# EAGLE design bristlebot (EAGLE 6.4)
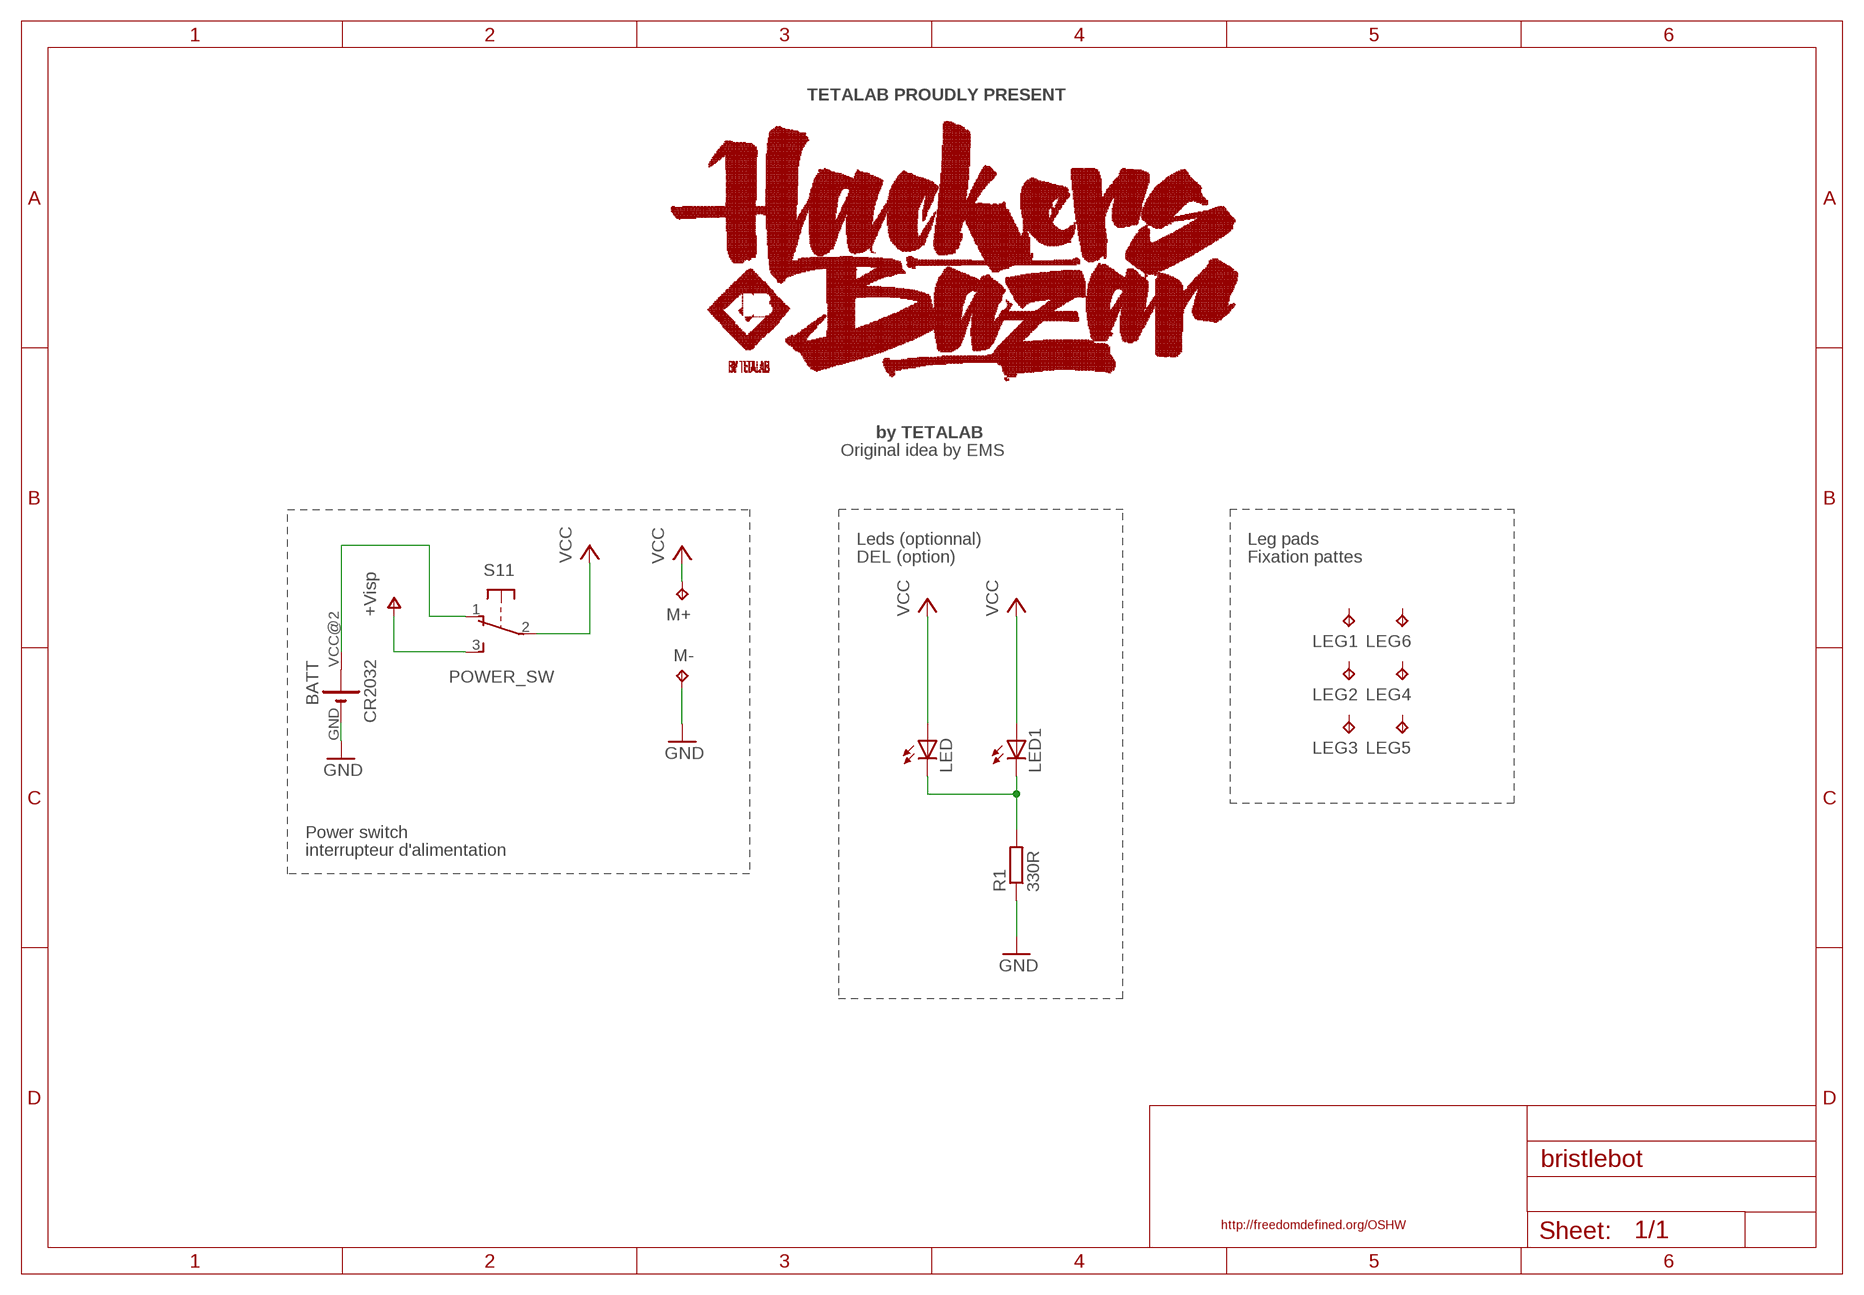
[diagram p0: schematic, sheet 1]

## Parts
BATT  CR2032  CR2032HCOMPACT  [BATT_CONN_CR2032]
LED  LED3MM  [LED3MM]
LED1  LED3MM  [LED3MM]
LEG1  TPPAD0.8-2.5R  [P0.8-2.5]
LEG2  TPPAD0.8-2.5R  [P0.8-2.5]
LEG3  TPPAD0.8-2.5R  [P0.8-2.5]
LEG4  TPPAD0.8-2.5R  [P0.8-2.5]
LEG5  TPPAD0.8-2.5R  [P0.8-2.5]
LEG6  TPPAD0.8-2.5R  [P0.8-2.5]
M+  TPPAD0.8-2R  [P0.8-2]
M-  TPPAD0.8-2R  [P0.8-2]
R1  330R  R-EU_0207/7  [0207/7]
S1  POWER_SW  SLIDING_SWITCH_SPDT-OS102011MA1QN1  [OS102011MA1QN1]

## Nets
GND: BATT.GND(-) M-.TP R1.1
N$12: LED1.K(C) LED.K(C) R1.2
V+: S1.3 ; supply symbol labelled +Visp
VBAT: BATT.VCC@2(+) S1.1
VCC: LED1.A LED.A M+.TP S1.2
Unconnected: BATT.VCC@1(+) LEG1.TP LEG2.TP LEG3.TP LEG4.TP LEG5.TP LEG6.TP S1.MT1(MT) S1.MT2(MT)

## Notes on the sheet
- TETALAB PROUDLY PRESENT
- by TETALAB
- Original idea by EMS
- Leds (optionnal) | Leg pads
- DEL (option) | Fixation pattes
- Power switch
- interrupteur d'alimentation
- http://freedomdefined.org/OSHW

## Library data of the parts
BATT = SnootLib:CR2032H: LI BATTERY CR2032
LED LED1 = led:LED: LED OSRAM: - CHIPLED LG R971, LG N971, LY N971, LG Q971, LY Q971, LO R971, LY R971 LH N974, LH R974 LS Q976, LO Q976, LY Q976 LO Q996 - Hyper CHIPLED LW Q18S LB Q993, LB Q99A, LB R99A - SideLED LS A670, LO A670, LY A670, LG A670, LP A670 LB A673, LV A673, LT A673, LW A673 LH A674 LY A675 LS A676, LA A676, LO A676, LY A676, LW A676 LS A679, LY A679, LG A679 - Hyper Micro SIDELED® LS Y876, LA Y876, LO Y876, LY Y876 LT Y87S - SmartLED LW L88C, LW L88S LB L89C, LB L89S, LG L890 LS L89K, LO L89K, LY L89K LS L896, LA L896, LO L896, LY L896 - TOPLED LS T670, LO T670, LY T670, LG T670, LP T670 LSG T670, LSP T670, LSY T670, LOP T670, LYG T670 LG T671, LOG T671, LSG T671 LB T673, LV T673, LT T673, LW T673 LH T674 LS T676, LA T676, LO T676, LY T676, LB T676, LH T676, LSB T676, LW T676 LB T67C, LV T67C, LT T67C, LS T67K, LO T67K, LY T67K, LW E67C LS E67B, LA E67B, LO E67B, LY E67B, LB E67C, LV E67C, LT E67C LW T67C LS T679, LY T679, LG T679 LS T770, LO T770, LY T770, LG T770, LP T770 LB T773, LV T773, LT T773, LW T773 LH T774 LS E675, LA E675, LY E675, LS T675 LS T776, LA T776, LO T776, LY T776, LB T776 LHGB T686 LT T68C, LB T68C - Hyper Mini TOPLED® LB M676 - Mini TOPLED Santana® LG M470 LS M47K, LO M47K, LY M47K Source: http://www.osram.convergy.de LUXEON: - LUMILED® LXK2-PW12-R00, LXK2-PW12-S00, LXK2-PW14-U00, LXK2-PW14-V00 LXK2-PM12-R00, LXK2-PM12-S00, LXK2-PM14-U00 LXK2-PE12-Q00, LXK2-PE12-R00, LXK2-PE12-S00, LXK2-PE14-T00, LXK2-PE14-U00 LXK2-PB12-K00, LXK2-PB12-L00, LXK2-PB12-M00, LXK2-PB14-N00, LXK2-PB14-P00, LXK2-PB14-Q00 LXK2-PR12-L00, LXK2-PR12-M00, LXK2-PR14-Q00, LXK2-PR14-R00 LXK2-PD12-Q00, LXK2-PD12-R00, LXK2-PD12-S00 LXK2-PH12-R00, LXK2-PH12-S00 LXK2-PL12-P00, LXK2-PL12-Q00, LXK2-PL12-R00 Source: www.luxeon.com KINGBRIGHT: KA-3528ASYC Source: www.kingbright.com
LEG1-LEG6 M+ M- = malib:TP: Test pad
R1 = resistor:R-EU_: RESISTOR, European symbol
S1 = SnootLib:SLIDING_SWITCH_SPDT: Sliding Switch right-angle SPDT

## Board
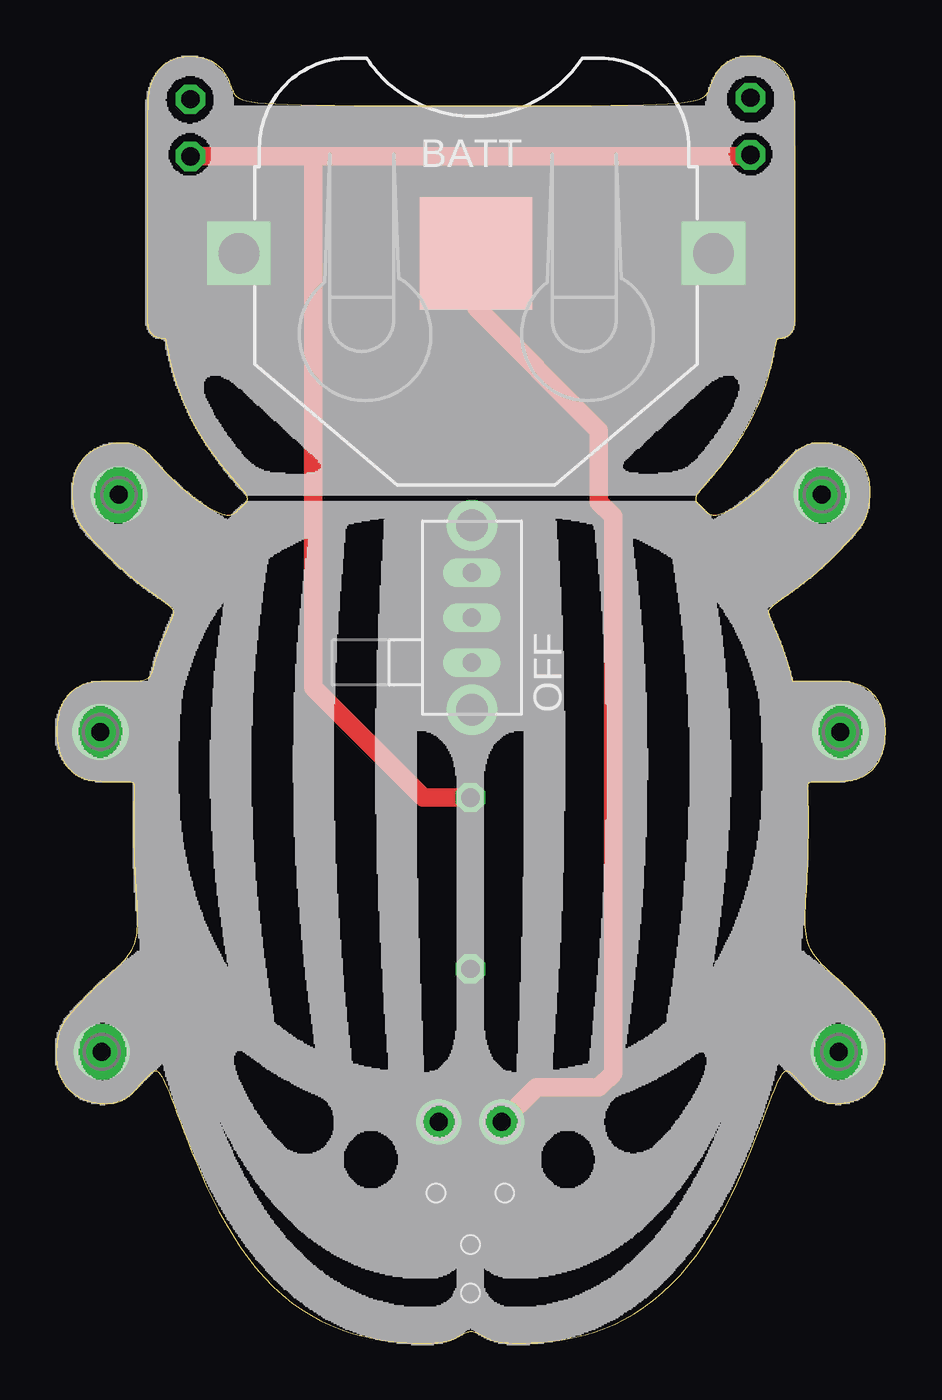
[diagram p1: board, top side]
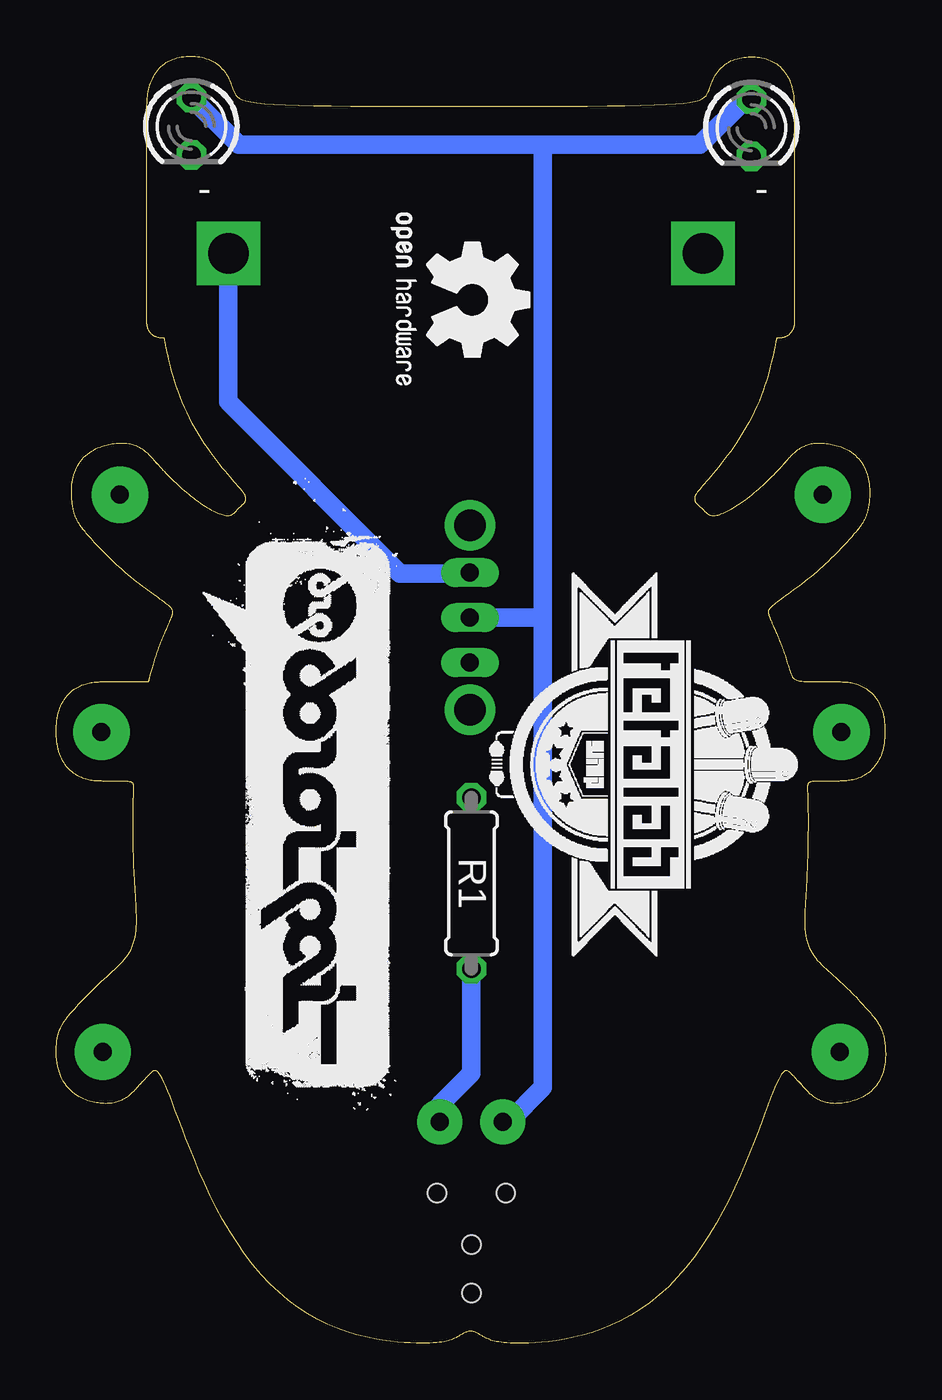
[diagram p2: board, bottom side, seen from below]

Size 36.86 x 57.23 mm. Coordinates in mm from the lower left corner, seen from the top.
Outline: 32.75,29.42 32.75,29.42 32.76,29.42 32.76,29.42 32.76,29.42 32.77,29.42 32.78,29.42 32.79,29.42 32.81,29.42 32.83,29.42 32.86,29.42 32.89,29.42 32.94,29.42 32.99,29.42 33.05,29.42 33.12,29.42 33.2,29.42 33.29,29.42 33.39,29.42 33.49,29.42 33.6,29.42 33.71,29.42 33.83,29.42 33.94,29.42 34.06,29.42 34.17,29.42 34.27,29.42 34.37,29.42 34.47,29.42 34.56,29.42 34.64,29.42 34.72,29.42 34.79,29.42 34.86,29.42 34.93,29.41 34.99,29.41 35.05,29.41 35.12,29.4 35.18,29.4 35.25,29.39 35.32,29.38 35.4,29.36 35.47,29.35 35.55,29.32 35.64,29.3 35.72,29.27 35.81,29.23 35.89,29.19 35.98,29.14 36.06,29.08 36.14,29.02 36.22,28.95 36.3,28.88 36.37,28.8 36.44,28.72 36.5,28.63 36.56,28.53 36.61,28.44 36.66,28.34 36.7,28.23 36.74,28.13 36.77,28.02 36.79,27.91 36.82,27.79 36.83,27.68 36.84,27.56 36.85,27.45 36.86,27.33 36.86,27.22 36.86,27.1 36.86,26.98 36.85,26.87 36.84,26.75 36.82,26.64 36.8,26.53 36.77,26.41 36.74,26.31 36.71,26.2 36.67,26.09 36.62,25.99 36.57,25.89 36.52,25.8 36.45,25.71 36.39,25.63 36.32,25.55 36.24,25.47 36.16,25.4 36.08,25.34 35.99,25.28 35.91,25.23 35.82,25.19 35.74,25.15 35.65,25.12 35.57,25.09 35.49,25.07 35.41,25.05 35.34,25.03 35.27,25.02 35.2,25.01 35.14,25 35.08,25 35.02,25 34.97,24.99 34.91,24.99 34.86,24.99 34.8,24.99 34.74,24.99 34.68,24.99 34.62,24.99 34.55,24.99 34.48,24.99 34.4,24.99 34.32,24.99 34.24,24.99 34.16,24.99 34.08,24.99 34,24.99 33.93,24.99 33.85,24.98 33.78,24.98 33.72,24.98 33.66,24.97 33.61,24.97 33.57,24.96 33.53,24.95 33.5,24.94 33.48,24.92 33.46,24.9 33.44,24.88 33.43,24.86 33.42,24.83 33.42,24.8 33.41,24.76 33.41,24.73 33.41,24.69 33.41,24.64 33.42,24.6 33.42,24.55 33.42,24.5 33.42,24.45 33.42,24.39 33.42,24.34 33.43,24.28 33.43,24.23 33.43,24.17 33.43,24.11 33.43,24.05 33.44,23.99 33.44,23.93 33.44,23.86 33.44,23.8 33.44,23.73 33.44,23.66 33.44,23.58 33.44,23.5 33.44,23.42 33.44,23.33 33.44,23.23 33.44,23.13 33.44,23.02 33.44,22.9 33.44,22.78 33.44,22.64 33.44,22.51 33.44,22.36 33.43,22.21 33.43,22.05 33.43,21.88 33.42,21.71 33.42,21.54 33.41,21.37 33.41,21.19 33.4,21.01 33.39,20.82 33.38,20.64 33.37,20.45 33.36,20.27 33.35,20.09 33.34,19.9 33.33,19.72 33.31,19.54 33.31,19.36 33.3,19.18 33.29,19.01 33.29,18.84 33.29,18.67 33.3,18.51 33.31,18.35 33.33,18.2 33.36,18.05 33.39,17.91 33.43,17.77 33.48,17.64 33.53,17.52 33.6,17.4 33.67,17.29 33.75,17.17 33.84,17.06 33.93,16.96 34.03,16.85 34.14,16.75 34.25,16.64 34.36,16.54 34.48,16.43 34.6,16.31 34.73,16.2 34.86,16.08 34.98,15.96 35.11,15.84 35.24,15.71 35.37,15.58 35.5,15.45 35.62,15.33 35.74,15.2 35.85,15.09 35.95,14.97 36.05,14.87 36.13,14.78 36.2,14.71 36.25,14.64 36.3,14.59 36.33,14.55 36.35,14.53 36.37,14.51 36.38,14.5 36.38,14.5 36.38,14.49 36.38,14.49 36.51,14.32 36.6,14.17 36.67,14.03 36.72,13.91 36.76,13.79 36.79,13.68 36.81,13.56 36.83,13.44 36.84,13.31 36.85,13.18 36.86,13.04 36.86,12.9 36.85,12.76 36.84,12.61 36.82,12.46 36.79,12.32 36.76,12.17 36.72,12.03 36.67,11.9 36.61,11.77 36.54,11.65 36.47,11.53 36.39,11.43 36.31,11.33 36.22,11.24 36.13,11.15 36.04,11.08 35.94,11.01 35.85,10.96 35.75,10.9 35.65,10.86 35.55,10.82 35.46,10.79 35.36,10.76 35.27,10.73 35.18,10.71 35.09,10.7 35,10.68 34.91,10.67 34.83,10.66 34.75,10.66 34.67,10.66 34.59,10.66 34.51,10.66 34.44,10.67 34.37,10.68 34.29,10.69 34.22,10.71 34.16,10.73 34.09,10.75 34.02,10.77 33.96,10.8 33.9,10.84 33.84,10.87 33.78,10.91 33.72,10.94 33.67,10.98 33.61,11.02 33.57,11.07 33.52,11.11 33.48,11.15 33.44,11.19 33.4,11.23 33.36,11.26 33.33,11.3 33.31,11.33 33.28,11.36 33.26,11.38 33.24,11.41 33.22,11.43 33.21,11.44 33.2,11.46 33.18,11.47 33.18,11.48 33.17,11.49 33.16,11.5 33.16,11.5 33.15,11.51 33.15,11.51 33.15,11.51 33.14,11.52 33.14,11.52 33.14,11.52 33.13,11.52 33.13,11.53 33.13,11.53 33.12,11.53 33.12,11.54 33.11,11.54 33.11,11.55 33.1,11.56 33.09,11.57 33.09,11.58 33.08,11.59 33.06,11.6 33.05,11.61 33.03,11.63 33.02,11.65 33,11.67 32.98,11.69 32.96,11.72 32.93,11.74 32.91,11.77 32.88,11.79 32.86,11.82 32.83,11.85 32.8,11.88 32.77,11.91 32.74,11.94 32.71,11.98 32.67,12.01 32.64,12.03 32.61,12.06 32.57,12.08 32.54,12.1 32.5,12.11 32.46,12.12 32.42,12.11 32.38,12.08 32.33,12.04 32.28,11.98 32.22,11.89 32.15,11.78 32.08,11.63 32,11.45 31.9,11.23 31.8,10.97 31.69,10.68 31.56,10.34 31.42,9.97 31.27,9.56 31.1,9.11 30.91,8.64 30.71,8.15 30.5,7.63 30.26,7.1 30.01,6.57 29.74,6.03 29.45,5.49 29.15,4.97 28.82,4.46 28.48,3.96 28.12,3.5 27.75,3.05 27.36,2.64 26.96,2.26 26.54,1.91 26.12,1.59 25.69,1.31 25.25,1.07 24.81,0.85 24.38,0.67 23.95,0.51 23.53,0.39 23.13,0.28 22.74,0.2 22.37,0.14 22.02,0.09 21.69,0.05 21.39,0.03 21.12,0.01 20.87,0 20.64,0 20.44,0 20.26,0.01 20.1,0.01 19.96,0.02 19.83,0.04 19.72,0.05 19.62,0.07 19.52,0.09 19.44,0.11 19.36,0.14 19.29,0.16 19.22,0.19 19.15,0.22 19.09,0.25 19.03,0.28 18.97,0.31 18.92,0.35 18.86,0.38 18.81,0.41 18.76,0.43 18.71,0.46 18.66,0.48 18.61,0.5 18.57,0.51 18.52,0.52 18.47,0.53 18.43,0.53 18.38,0.53 18.33,0.52 18.29,0.5 18.24,0.49 18.19,0.47 18.14,0.44 18.09,0.41 18.04,0.38 17.99,0.35 17.93,0.32 17.87,0.29 17.81,0.26 17.75,0.23 17.69,0.2 17.62,0.17 17.55,0.14 17.47,0.12 17.39,0.1 17.3,0.08 17.2,0.06 17.09,0.04 16.97,0.03 16.83,0.02 16.68,0.01 16.5,0 16.31,0 16.09,0 15.85,0.01 15.58,0.02 15.29,0.04 14.97,0.08 14.63,0.12 14.26,0.18 13.88,0.26 13.48,0.35 13.06,0.47 12.64,0.62 12.2,0.79 11.77,1 11.33,1.24 10.9,1.51 10.47,1.81 10.05,2.15 9.65,2.52 9.25,2.93 8.87,3.36 8.51,3.82 8.17,4.31 7.84,4.81 7.53,5.34 7.23,5.87 6.96,6.41 6.7,6.94 6.46,7.48 6.24,7.99 6.03,8.5 5.84,8.98 5.67,9.43 5.51,9.85 5.37,10.23 5.24,10.58 5.12,10.89 5.01,11.16 4.92,11.39 4.83,11.58 4.76,11.74 4.69,11.86 4.63,11.96 4.57,12.03 4.52,12.07 4.48,12.1 4.44,12.11 4.4,12.12 4.36,12.11 4.32,12.09 4.29,12.07 4.26,12.04 4.22,12.01 4.19,11.98 4.16,11.95 4.13,11.92 4.1,11.89 4.07,11.86 4.04,11.83 4.01,11.8 3.99,11.78 3.96,11.75 3.94,11.72 3.91,11.7 3.89,11.68 3.87,11.66 3.86,11.64 3.84,11.62 3.83,11.6 3.82,11.59 3.8,11.58 3.8,11.57 3.79,11.56 3.78,11.55 3.77,11.55 3.77,11.54 3.76,11.54 3.76,11.53 3.76,11.53 3.75,11.53 3.75,11.52 3.75,11.52 3.75,11.52 3.74,11.52 3.74,11.51 3.74,11.51 3.73,11.5 3.73,11.5 3.72,11.49 3.71,11.48 3.71,11.47 3.7,11.46 3.68,11.45 3.67,11.43 3.65,11.41 3.64,11.39 3.61,11.36 3.59,11.34 3.56,11.31 3.53,11.27 3.5,11.24 3.46,11.2 3.42,11.16 3.38,11.12 3.34,11.08 3.29,11.04 3.24,11 3.18,10.96 3.13,10.92 3.07,10.88 3.01,10.85 2.95,10.81 2.88,10.78 2.82,10.76 2.75,10.73 2.68,10.71 2.61,10.69 2.54,10.68 2.47,10.67 2.4,10.66 2.32,10.66 2.24,10.66 2.16,10.66 2.08,10.66 2,10.67 1.92,10.68 1.83,10.69 1.74,10.7 1.65,10.72 1.56,10.74 1.47,10.77 1.37,10.8 1.28,10.83 1.18,10.87 1.09,10.91 0.99,10.96 0.9,11.01 0.81,11.07 0.73,11.14 0.64,11.21 0.56,11.29 0.49,11.37 0.41,11.46 0.35,11.55 0.29,11.65 0.23,11.75 0.19,11.85 0.14,11.96 0.11,12.07 0.08,12.17 0.05,12.28 0.03,12.39 0.02,12.5 0.01,12.6 0,12.71 0,12.8 0,12.9 0,12.99 0.01,13.08 0.01,13.16 0.02,13.24 0.03,13.31 0.04,13.38 0.05,13.44 0.06,13.5 0.07,13.56 0.08,13.61 0.09,13.66 0.1,13.71 0.12,13.76 0.13,13.8 0.14,13.85 0.16,13.89 0.17,13.93 0.19,13.97 0.21,14.01 0.22,14.04 0.24,14.08 0.26,14.12 0.28,14.15 0.3,14.18 0.32,14.22 0.34,14.25 0.35,14.27 0.37,14.3 0.39,14.33 0.4,14.35 0.42,14.37 0.43,14.39 0.45,14.41 0.46,14.42 0.47,14.44 0.47,14.45 0.48,14.46 0.49,14.47 0.49,14.47 0.5,14.48 0.5,14.48 0.5,14.49 0.5,14.49 0.51,14.49 0.51,14.49 0.51,14.49 0.51,14.5 0.51,14.5 0.51,14.5 0.51,14.5 0.51,14.5 0.52,14.51 0.52,14.51 0.53,14.52 0.54,14.53 0.55,14.55 0.56,14.56 0.58,14.58 0.6,14.61 0.63,14.64 0.66,14.68 0.7,14.73 0.75,14.78 0.8,14.83 0.85,14.9 0.92,14.97 0.99,15.04 1.06,15.12 1.14,15.21 1.22,15.3 1.31,15.39 1.4,15.49 1.5,15.58 1.6,15.68 1.7,15.78 1.8,15.88 1.91,15.98 2.01,16.08 2.12,16.17 2.22,16.27 2.33,16.36 2.44,16.46 2.54,16.55 2.64,16.65 2.74,16.74 2.84,16.83 2.94,16.93 3.03,17.03 3.11,17.13 3.19,17.24 3.26,17.35 3.33,17.46 3.39,17.58 3.44,17.71 3.48,17.84 3.52,17.97 3.55,18.12 3.57,18.27 3.58,18.42 3.59,18.58 3.6,18.75 3.6,18.91 3.59,19.09 3.59,19.26 3.58,19.44 3.57,19.62 3.56,19.8 3.55,19.98 3.53,20.17 3.52,20.35 3.51,20.54 3.5,20.72 3.49,20.9 3.49,21.09 3.48,21.27 3.47,21.44 3.47,21.62 3.46,21.79 3.46,21.96 3.45,22.12 3.45,22.28 3.45,22.43 3.45,22.57 3.45,22.7 3.45,22.83 3.45,22.96 3.45,23.07 3.45,23.18 3.45,23.28 3.45,23.37 3.45,23.46 3.45,23.54 3.45,23.62 3.45,23.69 3.45,23.76 3.45,23.83 3.45,23.89 3.45,23.96 3.45,24.02 3.45,24.08 3.46,24.14 3.46,24.19 3.46,24.25 3.46,24.31 3.46,24.36 3.47,24.42 3.47,24.47 3.47,24.52 3.47,24.57 3.47,24.62 3.47,24.66 3.47,24.7 3.47,24.74 3.47,24.78 3.47,24.81 3.46,24.84 3.45,24.87 3.44,24.89 3.42,24.91 3.4,24.93 3.37,24.94 3.34,24.95 3.3,24.96 3.25,24.97 3.2,24.98 3.14,24.98 3.07,24.98 3,24.99 2.93,24.99 2.85,24.99 2.77,24.99 2.69,24.99 2.61,24.99 2.53,24.99 2.45,24.99 2.38,24.99 2.31,24.99 2.24,24.99 2.18,24.99 2.12,24.99 2.06,24.99 2,24.99 1.95,24.99 1.89,24.99 1.84,25 1.78,25 1.72,25.01 1.65,25.02 1.59,25.03 1.51,25.04 1.44,25.06 1.36,25.08 1.28,25.1 1.2,25.13 1.11,25.17 1.03,25.21 0.94,25.25 0.85,25.31 0.77,25.37 0.69,25.43 0.61,25.5 0.54,25.58 0.47,25.66 0.41,25.75 0.35,25.84 0.29,25.94 0.24,26.04 0.2,26.14 0.16,26.25 0.13,26.35 0.1,26.46 0.08,26.58 0.06,26.69 0.05,26.8 0.04,26.92 0.03,27.04 0.03,27.15 0.03,27.27 0.03,27.38 0.04,27.5 0.05,27.62 0.06,27.73 0.08,27.84 0.1,27.96 0.13,28.07 0.17,28.17 0.2,28.28 0.25,28.38 0.3,28.48 0.35,28.58 0.41,28.67 0.48,28.75 0.55,28.84 0.62,28.91 0.7,28.98 0.78,29.05 0.86,29.11 0.95,29.16 1.03,29.21 1.12,29.25 1.21,29.28 1.29,29.31 1.37,29.33 1.45,29.35 1.52,29.37 1.6,29.38 1.67,29.39 1.73,29.4 1.8,29.41 1.86,29.41 1.93,29.41 1.99,29.42 2.06,29.42 2.13,29.42 2.2,29.42 2.28,29.42 2.37,29.42 2.46,29.42 2.56,29.42 2.66,29.42 2.77,29.42 2.88,29.42 3,29.42 3.11,29.42 3.23,29.42 3.34,29.42 3.45,29.43 3.55,29.43 3.64,29.44 3.73,29.44 3.81,29.45 3.88,29.47 3.94,29.48 3.99,29.5 4.04,29.53 4.08,29.56 4.11,29.59 4.14,29.64 4.17,29.68 4.2,29.73 4.22,29.79 4.24,29.85 4.26,29.92 4.29,29.99 4.31,30.07 4.33,30.15 4.36,30.23 4.38,30.31 4.41,30.4 4.44,30.48 4.47,30.57 4.5,30.66 4.53,30.75 4.56,30.83 4.59,30.92 4.62,31.01 4.65,31.09 4.69,31.18 4.72,31.26 4.75,31.34 4.78,31.42 4.81,31.49 4.84,31.56 4.88,31.64 4.9,31.7 4.93,31.77 4.96,31.83 4.98,31.89 5.01,31.94 5.03,31.99 5.05,32.04 5.07,32.08 5.09,32.12 5.1,32.15 5.11,32.19 5.13,32.22 5.14,32.25 5.15,32.27 5.16,32.3 5.17,32.32 5.17,32.34 5.18,32.36 5.19,32.38 5.19,32.4 5.2,32.42 5.21,32.44 5.21,32.46 5.21,32.48 5.21,32.5 5.21,32.52 5.21,32.55 5.2,32.57 5.19,32.6 5.18,32.62 5.16,32.65 5.13,32.69 5.1,32.72 5.06,32.77 5.01,32.81 4.95,32.86 4.89,32.91 4.81,32.97 4.73,33.03 4.64,33.09 4.54,33.16 4.44,33.24 4.33,33.32 4.22,33.4 4.1,33.49 3.97,33.58 3.85,33.67 3.72,33.77 3.59,33.87 3.45,33.97 3.32,34.08 3.19,34.19 3.06,34.3 2.93,34.42 2.8,34.53 2.67,34.65 2.55,34.77 2.43,34.88 2.31,35 2.19,35.12 2.09,35.23 1.98,35.34 1.88,35.44 1.79,35.54 1.71,35.63 1.63,35.71 1.56,35.79 1.5,35.86 1.45,35.92 1.4,35.97 1.36,36.02 1.33,36.06 1.3,36.09 1.28,36.11 1.26,36.14 1.25,36.15 1.24,36.16 1.23,36.17 1.22,36.18 1.22,36.18 1.22,36.19 1.22,36.19 1.21,36.19 1.21,36.19 1.21,36.2 1.21,36.2 1.21,36.2 1.21,36.2 1.21,36.2 1.21,36.21 1.2,36.21 1.2,36.22 1.19,36.22 1.19,36.23 1.18,36.24 1.17,36.25 1.16,36.27 1.15,36.28 1.14,36.3 1.12,36.32 1.11,36.34 1.09,36.37 1.08,36.39 1.06,36.42 1.04,36.45 1.02,36.48 1,36.51 0.98,36.54 0.96,36.58 0.95,36.61 0.93,36.65 0.91,36.69 0.89,36.73 0.88,36.77 0.86,36.81 0.85,36.85 0.83,36.89 0.82,36.94 0.81,36.98 0.8,37.03 0.78,37.08 0.77,37.14 0.76,37.19 0.75,37.26 0.74,37.32 0.73,37.39 0.73,37.46 0.72,37.54 0.71,37.62 0.71,37.71 0.71,37.8 0.71,37.9 0.71,38 0.71,38.1 0.73,38.2 0.74,38.31 0.76,38.42 0.78,38.53 0.82,38.64 0.85,38.74 0.9,38.85 0.94,38.95 1,39.05 1.06,39.15 1.13,39.24 1.2,39.33 1.27,39.41 1.36,39.49 1.44,39.56 1.53,39.62 1.62,39.68 1.71,39.74 1.8,39.78 1.9,39.83 1.99,39.86 2.09,39.9 2.18,39.92 2.27,39.95 2.37,39.97 2.46,39.99 2.54,40 2.63,40.01 2.72,40.02 2.8,40.03 2.88,40.03 2.96,40.03 3.03,40.03 3.11,40.03 3.18,40.02 3.26,40.01 3.33,39.99 3.4,39.98 3.47,39.95 3.53,39.93 3.6,39.9 3.66,39.87 3.72,39.84 3.78,39.81 3.84,39.77 3.9,39.73 3.95,39.69 4,39.65 4.05,39.61 4.09,39.57 4.13,39.53 4.17,39.49 4.21,39.45 4.24,39.41 4.27,39.38 4.3,39.35 4.32,39.32 4.34,39.3 4.36,39.28 4.38,39.26 4.39,39.24 4.4,39.23 4.41,39.21 4.42,39.2 4.43,39.2 4.43,39.19 4.44,39.18 4.44,39.18 4.45,39.18 4.45,39.17 4.45,39.17 4.46,39.17 4.46,39.16 4.46,39.16 4.47,39.16 4.47,39.15 4.48,39.14 4.49,39.13 4.5,39.12 4.52,39.1 4.53,39.09 4.55,39.06 4.58,39.04 4.61,39 4.64,38.97 4.68,38.92 4.73,38.88 4.78,38.82 4.83,38.76 4.89,38.7 4.96,38.63 5.03,38.56 5.1,38.49 5.18,38.41 5.27,38.33 5.35,38.24 5.44,38.16 5.54,38.08 5.63,37.99 5.73,37.91 5.83,37.82 5.93,37.74 6.03,37.66 6.13,37.58 6.24,37.5 6.34,37.43 6.44,37.36 6.55,37.29 6.65,37.22 6.75,37.16 6.85,37.1 6.94,37.05 7.04,37 7.13,36.95 7.21,36.92 7.29,36.88 7.37,36.86 7.44,36.84 7.51,36.82 7.57,36.81 7.63,36.81 7.68,36.81 7.73,36.81 7.77,36.82 7.81,36.84 7.85,36.85 7.88,36.87 7.91,36.89 7.94,36.91 7.97,36.94 8,36.96 8.03,36.99 8.05,37.01 8.08,37.04 8.1,37.06 8.13,37.09 8.15,37.11 8.18,37.14 8.2,37.16 8.23,37.19 8.25,37.21 8.27,37.23 8.3,37.25 8.32,37.27 8.34,37.29 8.36,37.31 8.38,37.32 8.39,37.34 8.41,37.35 8.42,37.36 8.43,37.38 8.44,37.39 8.45,37.4 8.46,37.42 8.46,37.43 8.47,37.44 8.47,37.46 8.48,37.47 8.48,37.49 8.48,37.5 8.48,37.52 8.48,37.54 8.48,37.56 8.48,37.58 8.48,37.6 8.48,37.62 8.47,37.64 8.47,37.66 8.46,37.69 8.45,37.71 8.44,37.74 8.42,37.77 8.39,37.8 8.37,37.84 8.33,37.88 8.29,37.93 8.24,37.99 8.18,38.06 8.12,38.13 8.04,38.22 7.96,38.31 7.87,38.42 7.77,38.54 7.66,38.67 7.54,38.8 7.42,38.95 7.29,39.11 7.16,39.28 7.03,39.46 6.89,39.65 6.75,39.85 6.61,40.06 6.47,40.27 6.34,40.49 6.2,40.72 6.08,40.95 5.95,41.18 5.84,41.42 5.73,41.66 5.62,41.9 5.53,42.14 5.44,42.38 5.36,42.61 5.29,42.83 5.22,43.05 5.17,43.25 5.12,43.44 5.07,43.62 5.03,43.79 5,43.94 4.97,44.07 4.95,44.18 4.93,44.29 4.91,44.37 4.89,44.44 4.88,44.5 4.87,44.55 4.86,44.59 4.86,44.62 4.85,44.64 4.85,44.66 4.84,44.67 4.84,44.68 4.84,44.68 4.83,44.68 4.83,44.69 4.83,44.69 4.82,44.69 4.82,44.69 4.81,44.69 4.81,44.69 4.8,44.69 4.8,44.69 4.79,44.69 4.78,44.69 4.77,44.69 4.76,44.69 4.74,44.69 4.73,44.69 4.71,44.69 4.69,44.69 4.66,44.69 4.64,44.7 4.61,44.7 4.59,44.71 4.56,44.71 4.53,44.72 4.5,44.73 4.46,44.74 4.43,44.76 4.4,44.77 4.37,44.79 4.34,44.81 4.31,44.83 4.28,44.86 4.25,44.88 4.23,44.91 4.2,44.94 4.18,44.97 4.16,45 4.14,45.03 4.13,45.06 4.11,45.1 4.1,45.13 4.09,45.16 4.08,45.19 4.07,45.22 4.07,45.25 4.06,45.27 4.06,45.3 4.06,45.32 4.06,45.34 4.05,45.35 4.05,45.37 4.05,45.38 4.05,45.39 4.05,45.4 4.05,45.41 4.05,45.42 4.05,45.42 4.05,45.42 4.05,45.43 4.05,45.43 4.05,45.43 4.05,45.43
Outline: 32.75,29.42 32.75,29.42
Outline: 32.75,29.42 32.75,29.42
Outline: 32.75,29.42 32.75,29.42
Outline: 32.75,29.42 32.75,29.42
Outline: 32.75,29.42 32.75,29.42
Outline: 32.75,29.42 32.75,29.42
Outline: 32.75,29.42 32.75,29.42
Outline: 32.75,29.42 32.75,29.42
Outline: 32.75,29.42 32.75,29.42
Outline: 32.75,29.42 32.75,29.42 32.75,29.42 32.75,29.42 32.75,29.43 32.75,29.43 32.75,29.44 32.74,29.45 32.74,29.46 32.74,29.48 32.73,29.5 32.73,29.52 32.72,29.55 32.71,29.59 32.7,29.63 32.69,29.67 32.67,29.72 32.66,29.78 32.64,29.84 32.62,29.9 32.6,29.98 32.58,30.05 32.56,30.13 32.53,30.21 32.51,30.29 32.48,30.38 32.45,30.47 32.43,30.55 32.4,30.64 32.37,30.73 32.34,30.82 32.31,30.9 32.27,30.99 32.24,31.07 32.21,31.16 32.18,31.24 32.14,31.32 32.11,31.4 32.08,31.48 32.05,31.55 32.02,31.62 31.99,31.69 31.96,31.75 31.93,31.82 31.91,31.87 31.88,31.93 31.86,31.98 31.84,32.03 31.82,32.07 31.81,32.11 31.79,32.15 31.78,32.18 31.76,32.21 31.75,32.24 31.74,32.27 31.73,32.29 31.72,32.32 31.72,32.34 31.71,32.36 31.7,32.38 31.69,32.4 31.69,32.42 31.68,32.44 31.68,32.46 31.67,32.48 31.67,32.5 31.67,32.52 31.68,32.54 31.68,32.56 31.69,32.59 31.7,32.62 31.72,32.65 31.75,32.68 31.78,32.72 31.82,32.76 31.87,32.8 31.92,32.85 31.99,32.9 32.06,32.96 32.14,33.02 32.23,33.08 32.32,33.15 32.43,33.22 32.53,33.3 32.65,33.38 32.77,33.47 32.89,33.56 33.02,33.65 33.14,33.75 33.27,33.85 33.41,33.95 33.54,34.06 33.67,34.17 33.8,34.28 33.93,34.39 34.06,34.51 34.19,34.63 34.32,34.74 34.44,34.86 34.56,34.98 34.67,35.09 34.78,35.21 34.89,35.31 34.98,35.42 35.08,35.52 35.16,35.61 35.24,35.7 35.31,35.77 35.37,35.84 35.43,35.91 35.48,35.96 35.52,36.01 35.55,36.05 35.58,36.08 35.6,36.11 35.62,36.13 35.64,36.15 35.65,36.16 35.66,36.17 35.66,36.18 35.67,36.18 35.67,36.19 35.67,36.19 35.67,36.19 35.67,36.19 35.67,36.2 35.67,36.2 35.68,36.2 35.68,36.2 35.68,36.2 35.68,36.21 35.68,36.21 35.69,36.22 35.69,36.22 35.7,36.23 35.71,36.24 35.71,36.25 35.72,36.27 35.74,36.28 35.75,36.3 35.76,36.32 35.78,36.34 35.79,36.36 35.81,36.39 35.83,36.41 35.84,36.44 35.86,36.47 35.88,36.5 35.9,36.54 35.92,36.57 35.94,36.61 35.96,36.64 35.97,36.68 35.99,36.72 36.01,36.76 36.02,36.8 36.04,36.84 36.05,36.88 36.07,36.93 36.08,36.97 36.09,37.02 36.1,37.07 36.11,37.13 36.12,37.18 36.13,37.24 36.14,37.31 36.15,37.37 36.16,37.45 36.17,37.52 36.17,37.61 36.18,37.69 36.18,37.78 36.18,37.88 36.18,37.98 36.17,38.08 36.16,38.18 36.15,38.29 36.13,38.4 36.11,38.5 36.08,38.61 36.04,38.72 36,38.83 35.95,38.93 35.9,39.03 35.84,39.13 35.77,39.22 35.7,39.31 35.63,39.4 35.55,39.47 35.47,39.55 35.38,39.61 35.29,39.67 35.2,39.73 35.1,39.77 35.01,39.82 34.91,39.86 34.82,39.89 34.73,39.92 34.63,39.94 34.54,39.97 34.45,39.98 34.36,40 34.27,40.01 34.19,40.02 34.11,40.03 34.03,40.03 33.95,40.03 33.87,40.03 33.79,40.03 33.72,40.02 33.65,40.01 33.57,40 33.5,39.98 33.44,39.96 33.37,39.94 33.3,39.91 33.24,39.88 33.18,39.85 33.12,39.81 33.06,39.78 33,39.74 32.95,39.7 32.9,39.66 32.85,39.62 32.81,39.57 32.76,39.53 32.72,39.49 32.69,39.46 32.65,39.42 32.62,39.39 32.59,39.36 32.57,39.33 32.55,39.3 32.53,39.28 32.51,39.26 32.5,39.24 32.49,39.23 32.48,39.22 32.47,39.21 32.46,39.2 32.46,39.19 32.45,39.19 32.45,39.18 32.44,39.18 32.44,39.17 32.44,39.17 32.43,39.17 32.43,39.16 32.43,39.16 32.42,39.16 32.41,39.15 32.41,39.14 32.4,39.13 32.39,39.12 32.37,39.11 32.36,39.09 32.34,39.07 32.31,39.04 32.29,39.01 32.25,38.97 32.21,38.93 32.17,38.89 32.12,38.83 32.07,38.78 32.01,38.71 31.94,38.65 31.87,38.58 31.8,38.5 31.72,38.42 31.64,38.34 31.55,38.26 31.46,38.18 31.37,38.09 31.28,38.01 31.18,37.92 31.08,37.84 30.98,37.76 30.88,37.67 30.78,37.6 30.67,37.52 30.57,37.44 30.47,37.37 30.36,37.3 30.26,37.23 30.16,37.17 30.06,37.11 29.96,37.06 29.87,37.01 29.78,36.96 29.69,36.92 29.61,36.89 29.53,36.86 29.46,36.84 29.39,36.82 29.33,36.81 29.27,36.81 29.22,36.81 29.17,36.81 29.13,36.82 29.09,36.83 29.05,36.85 29.02,36.87 28.99,36.89 28.96,36.91 28.93,36.93 28.91,36.96 28.88,36.98 28.86,37.01 28.83,37.03 28.81,37.06 28.79,37.08 28.76,37.11 28.74,37.13 28.72,37.16 28.69,37.18 28.67,37.2 28.65,37.23 28.63,37.25 28.61,37.27 28.58,37.28 28.57,37.3 28.55,37.32 28.53,37.33 28.52,37.35 28.5,37.36 28.49,37.38 28.48,37.39 28.47,37.4 28.46,37.41 28.46,37.43 28.45,37.44 28.45,37.45 28.45,37.47 28.44,37.48 28.44,37.5 28.44,37.52 28.44,37.54 28.44,37.55 28.44,37.57 28.44,37.59 28.45,37.61 28.45,37.64 28.45,37.66 28.46,37.68 28.47,37.71 28.48,37.73 28.5,37.76 28.52,37.79 28.55,37.83 28.58,37.87 28.62,37.92 28.67,37.98 28.73,38.04 28.79,38.12 28.86,38.2 28.94,38.29 29.03,38.4 29.13,38.51 29.24,38.64 29.35,38.78 29.47,38.92 29.6,39.08 29.73,39.25 29.86,39.43 30,39.61 30.14,39.81 30.28,40.01 30.41,40.22 30.55,40.44 30.68,40.67 30.81,40.9 30.93,41.13 31.05,41.37 31.16,41.61 31.26,41.85 31.36,42.09 31.45,42.33 31.53,42.56 31.6,42.79 31.66,43 31.72,43.21 31.77,43.41 31.82,43.59 31.86,43.75 31.89,43.91 31.92,44.04 31.95,44.16 31.97,44.27 31.98,44.35 32,44.43 32.01,44.49 32.02,44.54 32.03,44.58 32.04,44.61 32.04,44.64 32.05,44.65 32.05,44.67 32.05,44.67 32.06,44.68 32.06,44.68 32.06,44.69 32.07,44.69 32.07,44.69 32.07,44.69 32.08,44.69 32.08,44.69 32.09,44.69 32.09,44.69 32.1,44.69 32.11,44.69 32.12,44.69 32.13,44.69 32.14,44.69 32.16,44.69 32.18,44.69 32.2,44.69 32.22,44.69 32.24,44.7 32.27,44.7 32.3,44.71 32.32,44.71 32.35,44.72 32.39,44.73 32.42,44.74 32.45,44.76 32.48,44.77 32.51,44.79 32.54,44.81 32.57,44.83 32.6,44.85 32.63,44.88 32.66,44.9 32.68,44.93 32.7,44.96 32.72,44.99 32.74,45.03 32.76,45.06 32.77,45.09 32.79,45.12 32.8,45.15 32.81,45.18 32.81,45.21 32.82,45.24 32.82,45.27 32.83,45.29 32.83,45.31 32.83,45.33 32.83,45.35 32.83,45.37 32.84,45.38 32.84,45.39 32.84,45.4 32.84,45.41 32.84,45.42 32.84,45.42 32.84,45.42 32.84,45.43 32.84,45.43 32.84,45.43 32.84,45.43 32.84,45.43 32.84,45.43
Outline: 32.84,45.43 32.84,45.43
Outline: 32.84,45.43 32.84,45.43
Outline: 32.84,45.43 32.84,45.43
Outline: 32.84,45.43 32.84,45.43
Outline: 32.84,45.43 32.84,45.43
Outline: 32.84,45.43 32.84,45.43
Outline: 32.84,45.43 32.84,45.43
Outline: 32.84,45.43 32.84,45.44 32.84,45.44 32.84,45.44 32.84,45.45 32.84,45.47 32.84,45.49 32.84,45.52 32.84,45.56 32.84,45.62 32.84,45.7 32.84,45.8 32.84,45.93 32.84,46.09 32.84,46.29 32.84,46.53 32.84,46.81 32.84,47.13 32.84,47.49 32.84,47.89 32.84,48.32 32.84,48.79 32.84,49.28 32.84,49.78 32.84,50.3 32.84,50.81 32.84,51.31 32.84,51.8 32.84,52.26 32.84,52.69 32.84,53.09 32.84,53.45 32.84,53.77 32.84,54.05 32.84,54.3 32.83,54.52 32.83,54.71 32.83,54.87 32.83,55.01 32.82,55.14 32.82,55.25 32.81,55.36 32.8,55.46 32.79,55.56 32.77,55.65 32.75,55.75 32.73,55.85 32.7,55.95 32.67,56.04 32.63,56.14 32.58,56.24 32.53,56.33 32.48,56.43 32.42,56.52 32.35,56.6 32.28,56.68 32.21,56.76 32.13,56.83 32.05,56.9 31.96,56.95 31.87,57.01 31.78,57.05 31.69,57.09 31.59,57.13 31.49,57.16 31.4,57.18 31.3,57.2 31.19,57.21 31.09,57.22 30.99,57.23 30.89,57.23 30.79,57.23 30.68,57.22 30.58,57.21 30.48,57.2 30.38,57.18 30.28,57.15 30.18,57.12 30.09,57.09 30,57.05 29.9,57 29.81,56.95 29.73,56.89 29.65,56.83 29.57,56.76 29.49,56.68 29.42,56.6 29.36,56.51 29.3,56.42 29.25,56.33 29.2,56.23 29.15,56.14 29.11,56.04 29.08,55.94 29.04,55.85 29.01,55.75 28.97,55.66 28.93,55.58 28.88,55.5 28.81,55.43 28.72,55.36 28.59,55.3 28.43,55.24 28.21,55.2 27.94,55.15 27.6,55.12 27.18,55.09 26.68,55.07 26.09,55.05 25.41,55.03 24.64,55.02 23.78,55.01 22.84,55.01 21.83,55 20.76,55 19.66,55 18.54,55 17.41,55 16.3,55 15.23,55 14.2,55 13.25,55.01 12.37,55.02 11.58,55.03 10.88,55.04 10.27,55.06 9.75,55.08 9.32,55.11 8.97,55.15 8.68,55.18 8.46,55.23 8.28,55.28 8.15,55.34 8.05,55.41 7.98,55.48 7.92,55.56 7.88,55.64 7.84,55.73 7.81,55.82 7.78,55.91 7.74,56.01 7.7,56.1 7.66,56.2 7.61,56.29 7.56,56.39 7.5,56.48 7.44,56.56 7.37,56.64 7.3,56.72 7.22,56.79 7.14,56.86 7.06,56.92 6.97,56.97 6.88,57.02 6.79,57.06 6.69,57.09 6.6,57.12 6.5,57.15 6.4,57.17 6.3,57.18 6.2,57.19 6.1,57.2 6,57.2 5.9,57.2 5.8,57.2 5.69,57.19 5.59,57.17 5.5,57.16 5.4,57.14 5.3,57.11 5.21,57.08 5.11,57.04 5.02,56.99 4.93,56.94 4.85,56.89 4.76,56.82 4.69,56.75 4.61,56.68 4.54,56.6 4.48,56.52 4.42,56.43 4.36,56.34 4.31,56.24 4.27,56.15 4.23,56.05 4.19,55.95 4.16,55.86 4.14,55.76 4.12,55.67 4.1,55.57 4.09,55.47 4.08,55.37 4.07,55.27 4.06,55.16 4.06,55.04 4.06,54.9 4.05,54.74 4.05,54.56 4.05,54.35 4.05,54.11 4.05,53.83 4.05,53.51 4.05,53.16 4.05,52.77 4.05,52.35 4.05,51.89 4.05,51.41 4.05,50.91 4.05,50.4 4.05,49.89 4.05,49.38 4.05,48.89 4.05,48.42 4.05,47.97 4.05,47.57 4.05,47.2 4.05,46.87 4.05,46.58 4.05,46.33 4.05,46.13 4.05,45.96 4.05,45.82 4.05,45.71 4.05,45.63 4.05,45.57 4.05,45.52 4.05,45.49 4.05,45.47 4.05,45.46 4.05,45.45 4.05,45.44 4.05,45.44 4.05,45.44 4.05,45.43 4.05,45.43
Outline: 4.05,45.43 4.05,45.43
Outline: 4.05,45.43 4.05,45.43
Outline: 4.05,45.43 4.05,45.43
Outline: 4.05,45.43 4.05,45.43
Outline: 4.05,45.43 4.05,45.43
Outline: 4.05,45.43 4.05,45.43
Outline: 4.05,45.43 4.05,45.43
Copper layers (1*16): Top 0.035mm / dielectric 1.5mm / Bottom 0.035mm
Design rules "zombadge_1.2_DRC_snoot *": minimum track width 10mil, minimum drill 24mil, track to track 7mil, track to pad 7mil, pad to pad 7mil, via to via 7mil, smd to smd 7mil, copper to edge 40mil, drill to drill 8mil, minimum pad ring 7mil, minimum via ring 8mil, stop-mask expansion 4mil, vias tented up to drill 0mil, thermal gap 30mil
Holes 0.8 mm at 16.88,6.67 19.93,6.67 18.41,4.39 18.41,2.23

### Footprints (pad centres in the part's own frame; a part is rotated, then mirrored left to right if it is on the bottom)
BATT_CONN_CR2032 = smd 5 x 5: GND 0,0 | drill 1.8 square: VCC@1 -10.55,0; VCC@2 10.55,0
LED3MM = drill 0.813 octagon: A -1.27,0; K 1.27,0
P0.8-2.5 = drill 0.8 pad 2.5: TP 0,0
P0.8-2 = drill 0.8 pad 2: TP 0,0
0207/7 = drill 0.813 octagon: 1 -3.81,0; 2 3.81,0
OS102011MA1QN1 = drill 0.8 long: 1 -2,0; 2 0,0; 3 2,0 | drill 1.4 pad 1.778: MT1 -4.1,0; MT2 4.1,0

### Placement (x,y rotation side)
BATT  18.66,48.46 0 top
LED  30.85,54.11 270 bottom
LED1  5.96,54.05 270 bottom
LEG1  2.79,37.73 0 top
LEG2  1.96,27.19 0 top
LEG3  2.03,12.96 0 top
LEG4  34.03,37.73 0 top
LEG5  34.86,27.19 90 top
LEG6  34.79,12.96 0 top
M+  17.01,9.85 0 top
M-  19.81,9.85 0 top
R1  18.41,20.45 90 bottom
S1  18.47,32.27 270 top
U$1  [LOGO_OH_FULL_H7]  22,50.26 270 bottom

### Tracks (layer width: path | path; a pad name or v marks a point on that pad's centre or on a via)
GND
  Top 0.813: BATT.GND 18.66,46.04 24.12,40.58 24.12,37.41 24.76,36.77 24.76,12.01 24.12,11.37 21.33,11.37 M-.TP
  Bottom 0.813: R1.1 18.41,12.01 19.04,11.37 19.81,10.61 M-.TP
N$12
  Top 0.813: LED1.K 11.42,52.78 | 11.42,52.78 30.79,52.78 LED.K | R1.2 16.31,24.26 11.42,29.15 11.42,52.78
VBAT
  Bottom 0.813: BATT.VCC@2 29.21,41.86 21.58,34.23 18.5,34.23 S1.1
VCC
  Bottom 0.813: LED1.A 6.22,55.32 8.25,53.28 15.23,53.28 | 15.23,53.28 28.76,53.28 LED.A | 15.23,53.28 15.23,34.23 15.23,32.33 | M+.TP 16.76,9.85 15.23,11.37 15.23,32.33 | S1.2 15.3,32.27 15.23,32.33

### Text on the board
tNames: OFF
bNames: - | -
201bmp: /Users/lionel/Desktop/compo.BMP